# Altium schematic sheet isoSPI_block.SchDoc
size 420 x 297 mm; DocumentNumber: ЛАЭ3.20.10.02.05.200 Э3; SheetNumber: 3
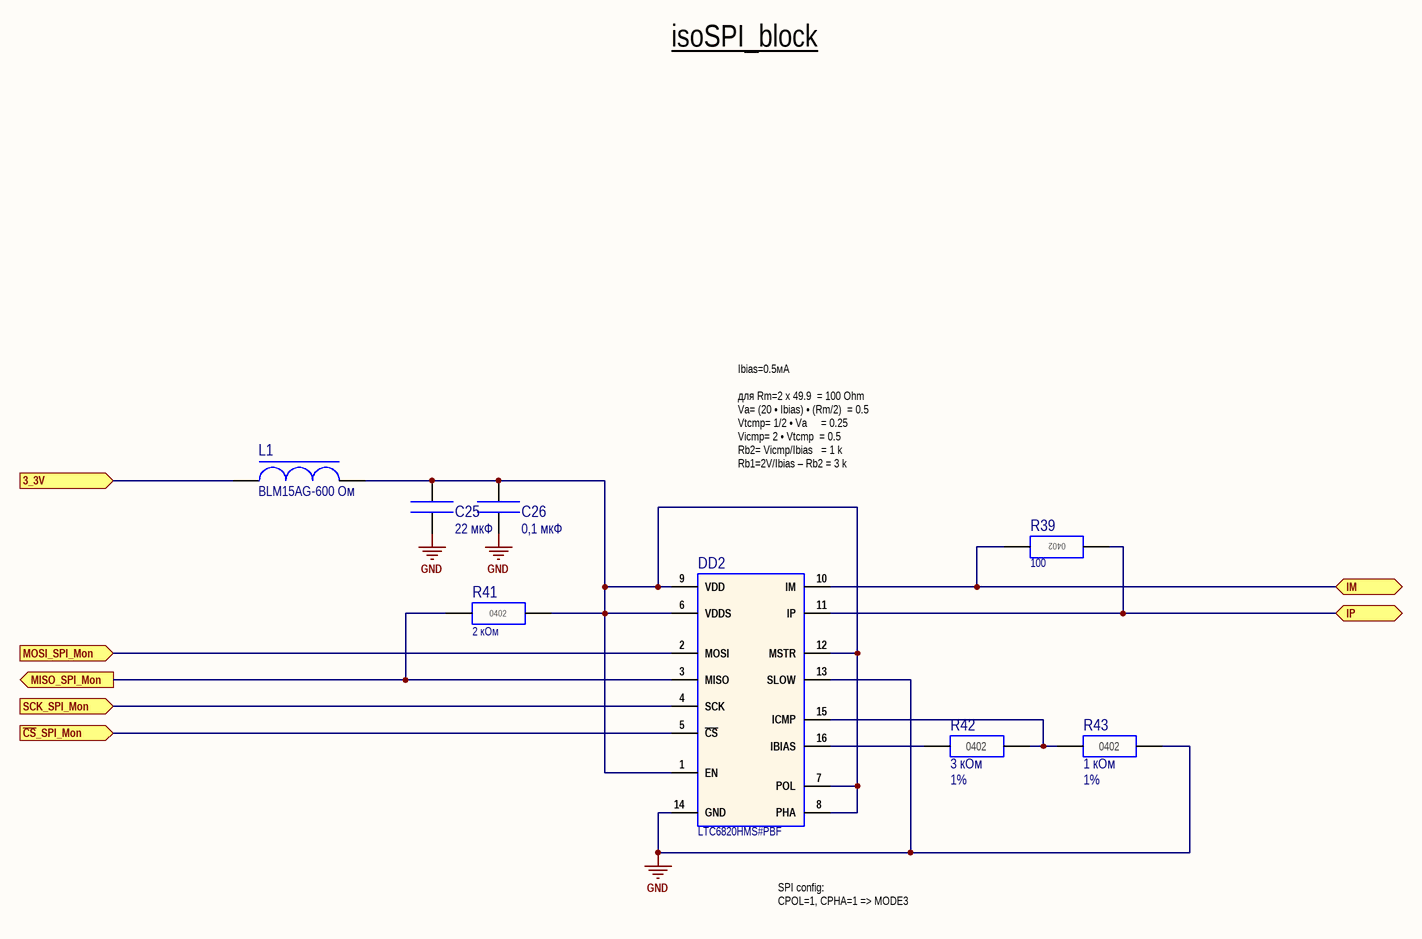
[diagram p0: isoSPI_block.SchDoc]

## Parts
C25  value 22 мкФ  [CC1206]  (hidden comment: CC1206-X7R-22 мкФ-20%-100В)
C26  value 0,1 мкФ  [CC0402(1005)]  (hidden comment: CC0402-X7R-0,1 мкФ-20%-50В)
DD2  LTC6820HMS#PBF  [MSOP-16_MS]
L1  BLM15AG-600 Ом  [CL0402(1005)]
R39  value 100  [CR0402(1005)]  (hidden comment: CR0402-100-±5%)
R41  value 2 кОм  [CR0402(1005)]  (hidden comment: CR0402-2 кОм-±5%)
R42  value 3 кОм  TOLERANCE: 1%  [CR0402(1005)]  (hidden comment: CR0402-3 кОм-±1%)
R43  value 1 кОм  TOLERANCE: 1%  [CR0402(1005)]  (hidden comment: CR0402-1 кОм-±1%)

## Ports
3_3V (in), IM (bidir), IP (bidir), MISO_SPI_Mon (out), MOSI_SPI_Mon (in), SCK_SPI_Mon (in), ~{CS}_SPI_Mon (in)

## Nets
GND: C25.2(-) C26.2(-) DD2.13(SLOW) DD2.14(GND) R43.2(-)
3_3V: L1.1 ; port 3_3V
~{CS}_SPI_Mon: DD2.5(~{CS}) ; port ~{CS}_SPI_Mon
IM: DD2.10(IM) R39.2(-) ; port IM
IP: DD2.11(IP) R39.1(+) ; port IP
MISO_SPI_Mon: DD2.3(MISO) R41.1(+) ; port MISO_SPI_Mon
MOSI_SPI_Mon: DD2.2(MOSI) ; port MOSI_SPI_Mon
SCK_SPI_Mon: DD2.4(SCK) ; port SCK_SPI_Mon
NetC25_1: C25.1(+) C26.1(+) DD2.1(EN) DD2.6(VDDS) DD2.7(POL) DD2.8(PHA) DD2.9(VDD) DD2.12(MSTR) L1.2 R41.2(-)
NetDD2_15: DD2.15(ICMP) R42.2(-) R43.1(+)
NetDD2_16: DD2.16(IBIAS) R42.1(+)

## Notes on the sheet
- isoSPI_block
- Ibias=0.5мА
  для Rm=2 x 49.9		= 100 Ohm
  Va= (20 • Ibias) • (Rm/2)  = 0.5
  Vtcmp= 1/2 • Va    	= 0.25
  Vicmp= 2 • Vtcmp		= 0.5
  Rb2= Vicmp/Ibias 		= 1 k
  Rb1=2V/Ibias – Rb2	= 3 k
- SPI config:
  CPOL=1, CPHA=1 => MODE3
- Подп. и дата
- Инв. № дубл.
- Взам. инв. №
- Инв. № подл.
- Изм.
- Лист
- № докум.
- Подп.
- Дата
- 2.106-A3
- Копировал
- Формат А3
- (in symbol CR0402-#-±1%) 0402
- (in symbol CR0402-#-±5%) 0402

## Library data of the parts
C25 = CC1206-X7R-#-20%-100В: Чип конденсатор керамический
C26 = CC0402-X7R-#-20%-50В: Чип конденсатор керамический; Supplier 1: Digi-Key; Supplier Part Number 1: 399-3066-1-ND
DD2 = LTC6820HMS#PBF: isoSPI Isolated Communications Interface; Vendor: Linear Technology; Manufacturer_Part_Number: ltc6820hms#pbf; Value: Value; Type: Type; RefDes: RefDes; DesignItemID: *; ComponentLink1Description: Datasheet; ComponentLink1URL: https://www.analog.com/media/en/technical-documentation/data-sheets/LTC6820.pdf
L1 = BLM15: Чип индуктивность подавления EMP; VALUE: 600 Ом; Компэл: BLM15AG601SN1D; Supplier 1: Farnell; Supplier Part Number 1: 1515762
R39 R41 = CR0402-#-±5%: Чип резистор; Maximum Working Voltage: 50 В; TOLERANCE: 5%; Supplier 1: Digi-Key; Supplier Part Number 1: 311-10.0KLRDKR-ND
R42 R43 = CR0402-#-±1%: Чип резистор; Maximum Working Voltage: 50 В; Supplier 1: Digi-Key; Supplier Part Number 1: 311-10.0KLRDKR-ND